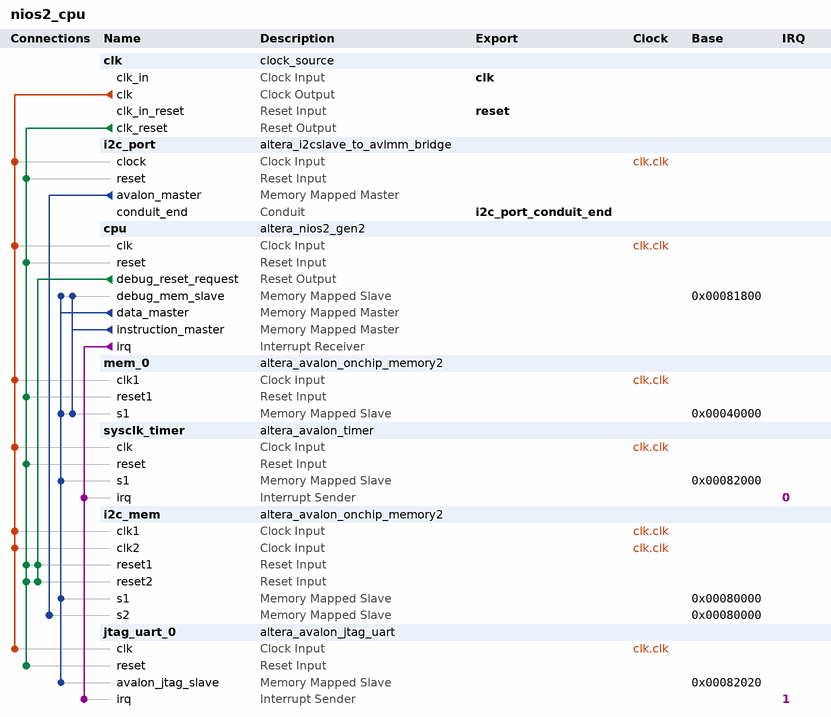
[diagram p0: system contents]
# Platform Designer (Qsys) system nios2_cpu, MAX 10 10M50DAF484C7G
# Parameters at their usual value, and those the tool derives, are not listed.
package require -exact qsys 20.1
create_system nios2_cpu
set_project_property DEVICE_FAMILY {MAX 10}
set_project_property DEVICE 10M50DAF484C7G

add_instance clk clock_source 20.1
set_instance_parameter_value clk clockFrequency 50000000

add_instance i2c_port altera_i2cslave_to_avlmm_bridge 20.1
set_instance_parameter_value i2c_port ADDRESS_STEALING 0
set_instance_parameter_value i2c_port BYTE_ADDRESSING 4
set_instance_parameter_value i2c_port I2C_SLAVE_ADDRESS 85
set_instance_parameter_value i2c_port READ_ONLY 0

add_instance cpu altera_nios2_gen2 20.1
set_instance_parameter_value cpu dcache_size 2048
set_instance_parameter_value cpu exceptionSlave mem_0.s1
set_instance_parameter_value cpu icache_size 4096
set_instance_parameter_value cpu impl Tiny
set_instance_parameter_value cpu resetSlave mem_0.s1

add_instance mem_0 altera_avalon_onchip_memory2 20.1
set_instance_parameter_value mem_0 dataWidth 32
set_instance_parameter_value mem_0 dualPort false
set_instance_parameter_value mem_0 initMemContent false
set_instance_parameter_value mem_0 initializationFileName onchip_mem.hex
set_instance_parameter_value mem_0 memorySize 140000

add_instance sysclk_timer altera_avalon_timer 20.1
set_instance_parameter_value sysclk_timer period 1
set_instance_parameter_value sysclk_timer periodUnits MSEC

add_instance i2c_mem altera_avalon_onchip_memory2 20.1
set_instance_parameter_value i2c_mem dataWidth 32
set_instance_parameter_value i2c_mem dualPort true
set_instance_parameter_value i2c_mem initMemContent false
set_instance_parameter_value i2c_mem initializationFileName onchip_mem.hex
set_instance_parameter_value i2c_mem memorySize 4096

add_instance jtag_uart_0 altera_avalon_jtag_uart 20.1
set_instance_parameter_value jtag_uart_0 simInteractiveOptions NO_INTERACTIVE_WINDOWS

# connections
add_connection clk.clk cpu.clk clock
add_connection clk.clk i2c_mem.clk1 clock
add_connection clk.clk i2c_mem.clk2 clock
add_connection clk.clk i2c_port.clock clock
add_connection clk.clk jtag_uart_0.clk clock
add_connection clk.clk mem_0.clk1 clock
add_connection clk.clk sysclk_timer.clk clock
add_connection clk.clk_reset cpu.reset reset
add_connection clk.clk_reset i2c_mem.reset1 reset
add_connection clk.clk_reset i2c_mem.reset2 reset
add_connection clk.clk_reset i2c_port.reset reset
add_connection clk.clk_reset jtag_uart_0.reset reset
add_connection clk.clk_reset mem_0.reset1 reset
add_connection clk.clk_reset sysclk_timer.reset reset
add_connection cpu.debug_reset_request i2c_mem.reset1 reset
add_connection cpu.debug_reset_request i2c_mem.reset2 reset
add_connection cpu.data_master cpu.debug_mem_slave avalon
set_connection_parameter_value cpu.data_master/cpu.debug_mem_slave baseAddress 0x00081800
add_connection cpu.data_master i2c_mem.s1 avalon
set_connection_parameter_value cpu.data_master/i2c_mem.s1 baseAddress 0x00080000
add_connection cpu.data_master jtag_uart_0.avalon_jtag_slave avalon
set_connection_parameter_value cpu.data_master/jtag_uart_0.avalon_jtag_slave baseAddress 0x00082020
add_connection cpu.data_master mem_0.s1 avalon
set_connection_parameter_value cpu.data_master/mem_0.s1 baseAddress 0x00040000
add_connection cpu.data_master sysclk_timer.s1 avalon
set_connection_parameter_value cpu.data_master/sysclk_timer.s1 baseAddress 0x00082000
add_connection cpu.instruction_master cpu.debug_mem_slave avalon
set_connection_parameter_value cpu.instruction_master/cpu.debug_mem_slave baseAddress 0x00081800
add_connection cpu.instruction_master mem_0.s1 avalon
set_connection_parameter_value cpu.instruction_master/mem_0.s1 baseAddress 0x00040000
add_connection i2c_port.avalon_master i2c_mem.s2 avalon
set_connection_parameter_value i2c_port.avalon_master/i2c_mem.s2 baseAddress 0x00080000
add_connection cpu.irq jtag_uart_0.irq interrupt
set_connection_parameter_value cpu.irq/jtag_uart_0.irq irqNumber 1
add_connection cpu.irq sysclk_timer.irq interrupt
set_connection_parameter_value cpu.irq/sysclk_timer.irq irqNumber 0

# exported interfaces
add_interface clk clock sink
set_interface_property clk EXPORT_OF clk.clk_in
add_interface i2c_port_conduit_end conduit end
set_interface_property i2c_port_conduit_end EXPORT_OF i2c_port.conduit_end
add_interface reset reset sink
set_interface_property reset EXPORT_OF clk.clk_in_reset

set_interconnect_requirement {$system} qsys_mm.clockCrossingAdapter HANDSHAKE
set_interconnect_requirement {$system} qsys_mm.enableEccProtection FALSE
set_interconnect_requirement {$system} qsys_mm.insertDefaultSlave FALSE
set_interconnect_requirement {$system} qsys_mm.maxAdditionalLatency 1

save_system nios2_cpu.qsys
